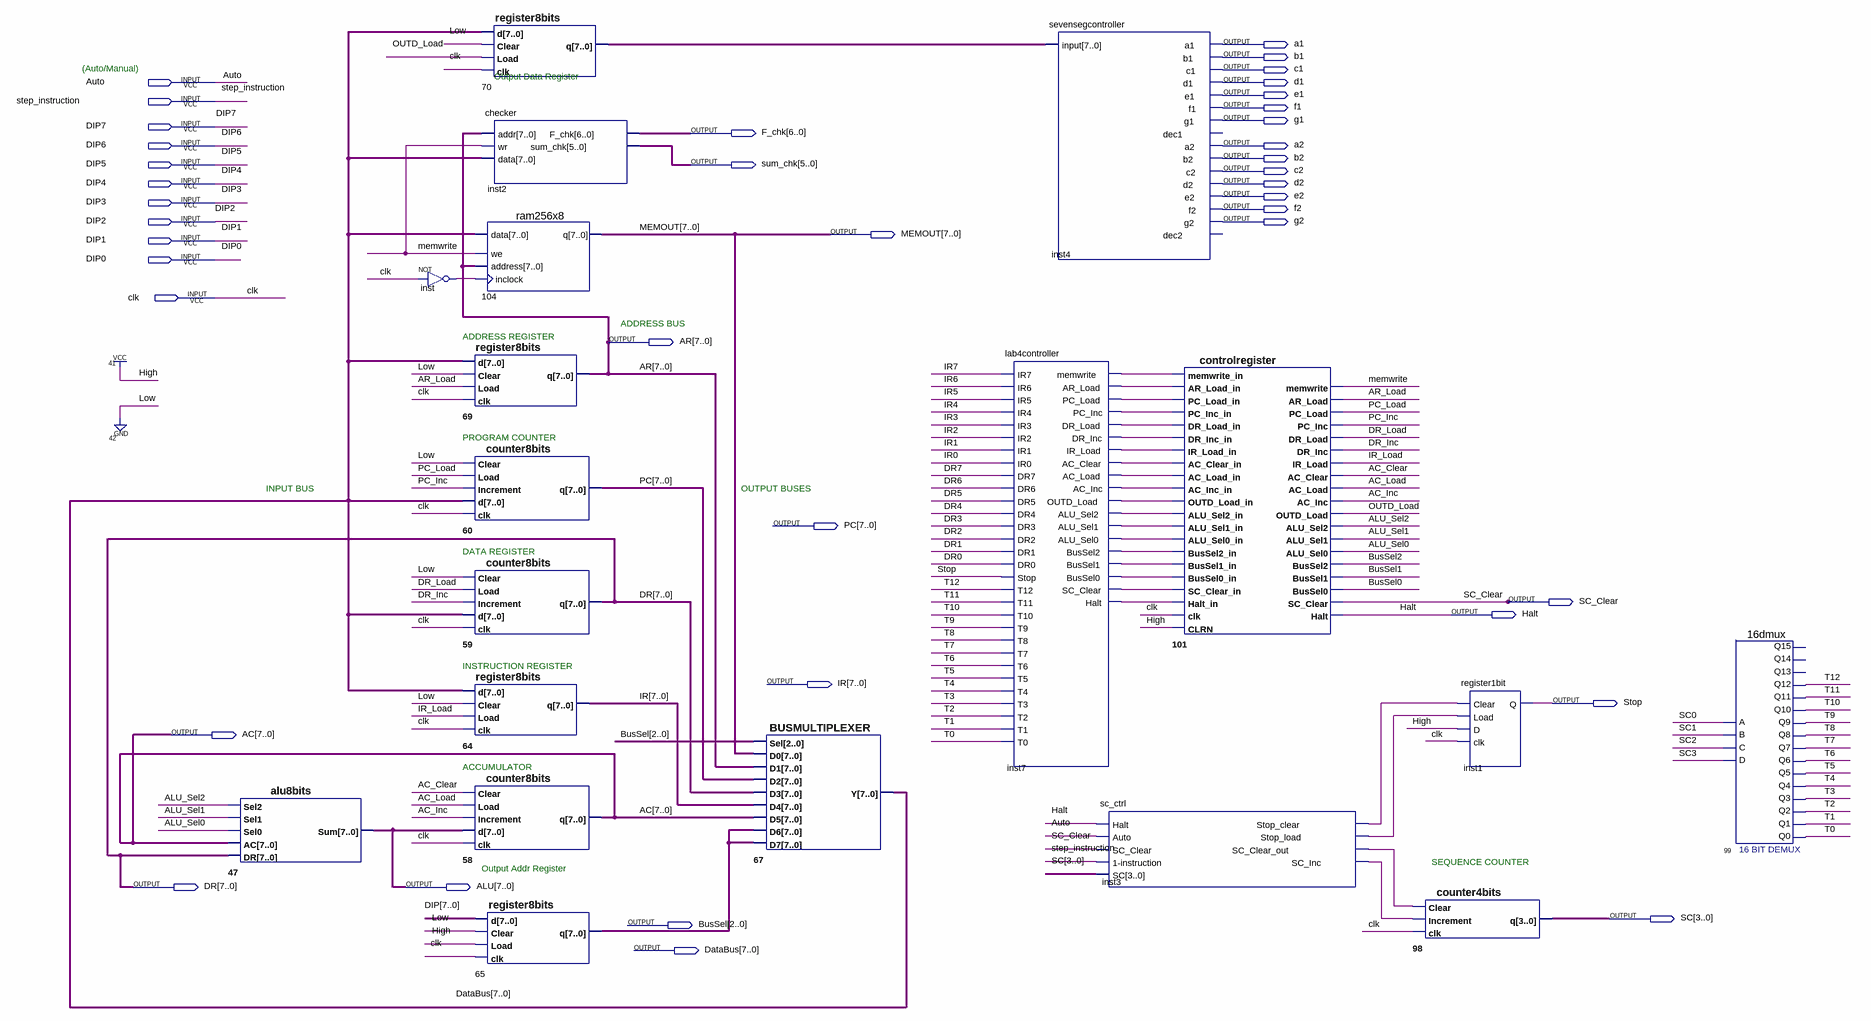
[diagram p0: schematic sheet]
// Quartus schematic lab4top.bdf as structural Verilog: 19 symbols, 40 pins
module lab4top (
  input  Auto,
  input  step_instruction,
  input  DIP7,
  input  DIP6,
  input  DIP5,
  input  DIP4,
  input  DIP3,
  input  DIP2,
  input  DIP1,
  input  DIP0,
  input  clk,
  output a1,
  output b1,
  output c1,
  output d1,
  output e1,
  output f1,
  output g1,
  output [6:0] F_chk,
  output a2,
  output b2,
  output [5:0] sum_chk,
  output c2,
  output d2,
  output e2,
  output f2,
  output g2,
  output [7:0] MEMOUT,
  output [7:0] AR,
  output [7:0] PC,
  output SC_Clear,
  output Halt,
  output [7:0] IR,
  output Stop,
  output [7:0] AC,
  output [7:0] DR,
  output [7:0] ALU,
  output [3:0] SC,
  output [2:0] BusSel,
  output [7:0] DataBus
);

  wire AC_Clear, AC_Inc, AC_Load, ALU_Sel0, ALU_Sel1, ALU_Sel2, AR_Load, DR_Inc, DR_Load, inst3_sc_clear_out,
       inst3_sc_inc, inst3_stop_clear, inst3_stop_load, inst7_ac_clear, inst7_ac_inc, inst7_ac_load,
       inst7_alu_sel0, inst7_alu_sel1, inst7_alu_sel2, inst7_ar_load, inst7_bussel0, inst7_bussel1,
       inst7_bussel2, inst7_dr_inc, inst7_dr_load, inst7_halt, inst7_ir_load, inst7_memwrite,
       inst7_outd_load, inst7_pc_inc, inst7_pc_load, inst7_sc_clear, inst_out, IR_Load, memwrite, OUTD_Load,
       PC_Inc, PC_Load, T0, T1, T2, T3, T4, T5, T6, T7, T8, T9, T10, T11, T12;
  wire [7:0] n65_q, n70_q;

  alu8bits u_47 (.Sel2(ALU_Sel2), .Sel1(ALU_Sel1), .Sel0(ALU_Sel0), .AC(AC), .DR(DR), .Sum(ALU));
  not inst (inst_out, clk);
  register8bits u_70 (.d(DataBus), .Clear(1'b0), .Load(OUTD_Load), .clk(clk), .q(n70_q));
  \checker  inst2 (.addr(AR), .wr(memwrite), .data(DataBus), .F_chk(F_chk), .sum_chk(sum_chk));
  ram256x8 u_104 (.data(DataBus), .we(memwrite), .address(AR), .inclock(inst_out), .q(MEMOUT));
  register8bits u_69 (.d(DataBus), .Clear(1'b0), .Load(AR_Load), .clk(clk), .q(AR));
  counter8bits u_60 (.Clear(1'b0), .Load(PC_Load), .Increment(PC_Inc), .d(DataBus), .clk(clk), .q(PC));
  counter8bits u_59 (.Clear(1'b0), .Load(DR_Load), .Increment(DR_Inc), .d(DataBus), .clk(clk), .q(DR));
  register8bits u_64 (.d(DataBus), .Clear(1'b0), .Load(IR_Load), .clk(clk), .q(IR));
  counter8bits u_58 (.Clear(AC_Clear), .Load(AC_Load), .Increment(AC_Inc), .d(ALU), .clk(clk), .q(AC));
  register8bits u_65 (
    .d({DIP7, DIP6, DIP5, DIP4, DIP3, DIP2, DIP1, DIP0}), .Clear(1'b0), .Load(1'b1), .clk(clk), .q(n65_q));
  BUSMULTIPLEXER u_67 (
    .Sel(BusSel), .D0(MEMOUT), .D1(AR), .D2(PC), .D3(DR), .D4(IR), .D5(AC), .D6(n65_q), .D7(n65_q),
    .Y(DataBus));
  sevensegcontroller inst4 (
    .\input (n70_q), .a1(a1), .b1(b1), .c1(c1), .d1(d1), .e1(e1), .f1(f1), .g1(g1), .a2(a2), .b2(b2),
    .c2(c2), .d2(d2), .e2(e2), .f2(f2), .g2(g2));  // open: dec1, dec2
  lab4controller inst7 (
    .IR7(IR[7]), .IR6(IR[6]), .IR5(IR[5]), .IR4(IR[4]), .IR3(IR[3]), .IR2(IR[2]), .IR1(IR[1]), .IR0(IR[0]),
    .DR7(DR[7]), .DR6(DR[6]), .DR5(DR[5]), .DR4(DR[4]), .DR3(DR[3]), .DR2(DR[2]), .DR1(DR[1]), .DR0(DR[0]),
    .Stop(Stop), .T12(T12), .T11(T11), .T10(T10), .T9(T9), .T8(T8), .T7(T7), .T6(T6), .T5(T5), .T4(T4),
    .T3(T3), .T2(T2), .T1(T1), .T0(T0), .memwrite(inst7_memwrite), .AR_Load(inst7_ar_load),
    .PC_Load(inst7_pc_load), .PC_Inc(inst7_pc_inc), .DR_Load(inst7_dr_load), .DR_Inc(inst7_dr_inc),
    .IR_Load(inst7_ir_load), .AC_Clear(inst7_ac_clear), .AC_Load(inst7_ac_load), .AC_Inc(inst7_ac_inc),
    .OUTD_Load(inst7_outd_load), .ALU_Sel2(inst7_alu_sel2), .ALU_Sel1(inst7_alu_sel1),
    .ALU_Sel0(inst7_alu_sel0), .BusSel2(inst7_bussel2), .BusSel1(inst7_bussel1), .BusSel0(inst7_bussel0),
    .SC_Clear(inst7_sc_clear), .Halt(inst7_halt));
  sc_ctrl inst3 (
    .Halt(Halt), .Auto(Auto), .SC_Clear(SC_Clear), .\1-instruction (step_instruction), .SC(SC),
    .Stop_clear(inst3_stop_clear), .Stop_load(inst3_stop_load), .SC_Clear_out(inst3_sc_clear_out),
    .SC_Inc(inst3_sc_inc));
  controlregister u_101 (
    .memwrite_in(inst7_memwrite), .AR_Load_in(inst7_ar_load), .PC_Load_in(inst7_pc_load),
    .PC_Inc_in(inst7_pc_inc), .DR_Load_in(inst7_dr_load), .DR_Inc_in(inst7_dr_inc),
    .IR_Load_in(inst7_ir_load), .AC_Clear_in(inst7_ac_clear), .AC_Load_in(inst7_ac_load),
    .AC_Inc_in(inst7_ac_inc), .OUTD_Load_in(inst7_outd_load), .ALU_Sel2_in(inst7_alu_sel2),
    .ALU_Sel1_in(inst7_alu_sel1), .ALU_Sel0_in(inst7_alu_sel0), .BusSel2_in(inst7_bussel2),
    .BusSel1_in(inst7_bussel1), .BusSel0_in(inst7_bussel0), .SC_Clear_in(inst7_sc_clear),
    .Halt_in(inst7_halt), .clk(clk), .CLRN(1'b1), .memwrite(memwrite), .AR_Load(AR_Load), .PC_Load(PC_Load),
    .PC_Inc(PC_Inc), .DR_Load(DR_Load), .DR_Inc(DR_Inc), .IR_Load(IR_Load), .AC_Clear(AC_Clear),
    .AC_Load(AC_Load), .AC_Inc(AC_Inc), .OUTD_Load(OUTD_Load), .ALU_Sel2(ALU_Sel2), .ALU_Sel1(ALU_Sel1),
    .ALU_Sel0(ALU_Sel0), .BusSel2(BusSel[2]), .BusSel1(BusSel[1]), .BusSel0(BusSel[0]), .SC_Clear(SC_Clear),
    .Halt(Halt));
  counter4bits u_98 (.Clear(inst3_sc_clear_out), .Increment(inst3_sc_inc), .clk(clk), .q(SC));
  register1bit inst1 (.Clear(inst3_stop_clear), .Load(inst3_stop_load), .D(1'b1), .clk(clk), .Q(Stop));
  \16dmux  u_99 (
    .A(SC[0]), .B(SC[1]), .C(SC[2]), .D(SC[3]), .Q12(T12), .Q11(T11), .Q9(T9), .Q8(T8), .Q7(T7), .Q10(T10),
    .Q6(T6), .Q5(T5), .Q4(T4), .Q3(T3), .Q2(T2), .Q1(T1), .Q0(T0));  // open: Q14, Q13, Q15

  // Notes on the sheet:
  //   (Auto/Manual)
  //   Output Data Register
  //   ADDRESS BUS
  //   ADDRESS REGISTER
  //   PROGRAM COUNTER
  //   INPUT BUS
  //   OUTPUT BUSES
  //   DATA REGISTER
  //   INSTRUCTION REGISTER
  //   ACCUMULATOR
  //   SEQUENCE COUNTER
  //   Output Addr Register
endmodule
